# EAGLE design reactor (EAGLE 6.3)
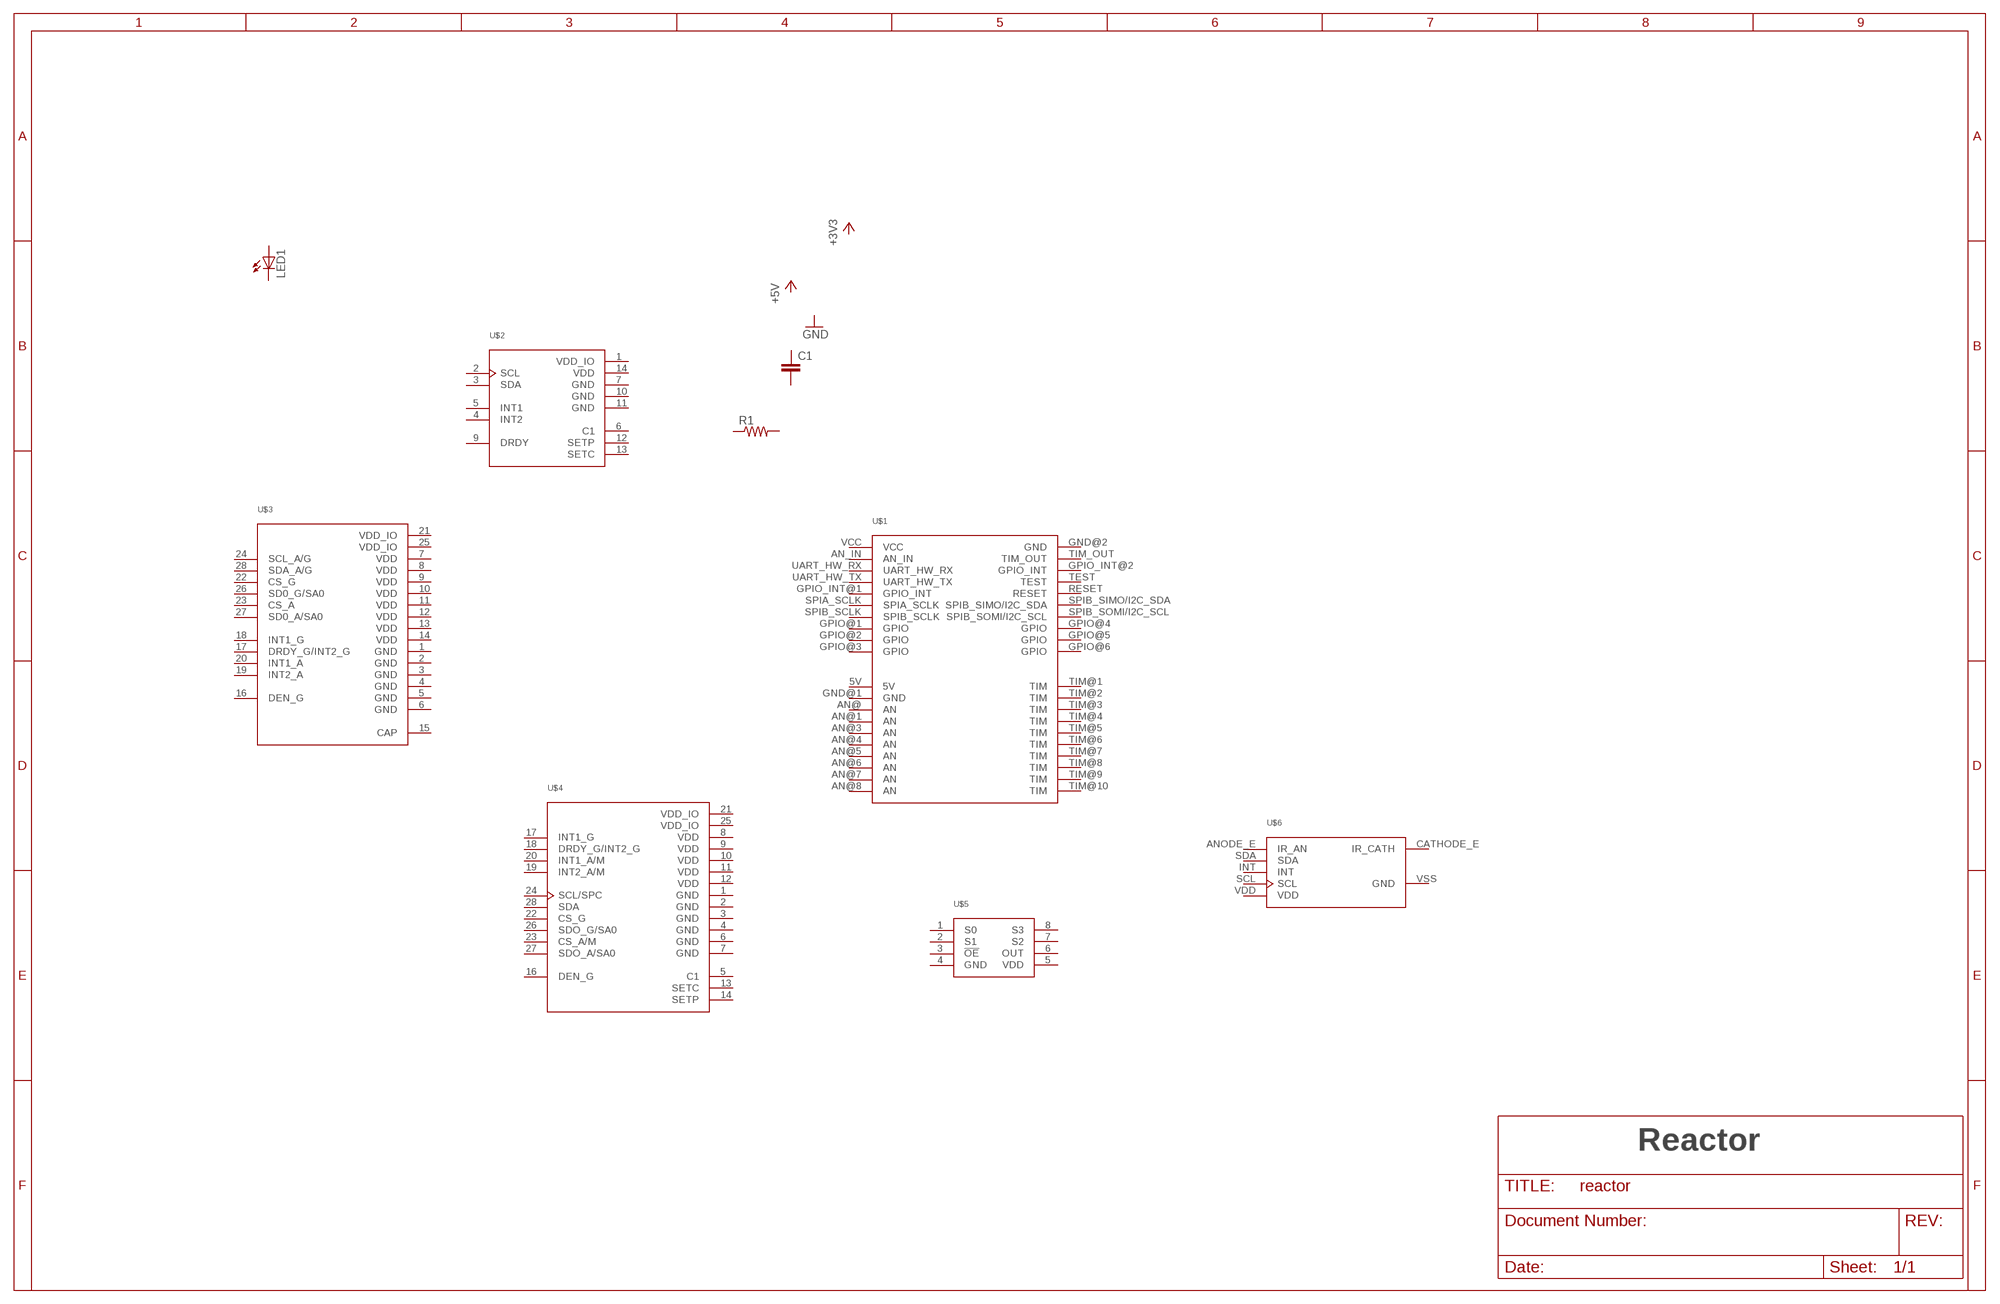
[diagram p0: schematic, sheet 1]

## Parts
C1  C-EUC0603  [C0603]
LED1  LEDCHIP-LED0603  [CHIP-LED0603]
R1  R-US_R0603  [R0603]
U$1  LAUNCHPAD_BOOSTER_PACK  [LAUNCHPAD_BOOSTER_PACK]
U$2  LSM303DLHC  [LGA14]
U$3  LSM330DLC  [LGA28-4X5]
U$4  LSM333D  [LGA28]
U$5  TCS32X0  [SOIC8]
U$6  VCNL3020  [VCNL3020]
Unconnected: C1.1 C1.2 LED1.A LED1.C R1.1 R1.2 U$1.AN@1(AN) U$1.AN@3(AN) U$1.AN@4(AN) U$1.AN@5(AN) U$1.AN@6(AN) U$1.AN@7(AN) U$1.AN@8(AN) U$1.AN@(AN) U$1.AN_IN U$1.GPIO@1(GPIO) U$1.GPIO@2(GPIO) U$1.GPIO@3(GPIO) U$1.GPIO@4(GPIO) U$1.GPIO@5(GPIO) U$1.GPIO@6(GPIO) U$1.GPIO_INT@1(GPIO_INT) U$1.GPIO_INT@2(GPIO_INT) U$1.RESET U$1.SPIA_SCLK U$1.SPIB_SCLK U$1.SPIB_SIMO/I2C_SDA U$1.SPIB_SOMI/I2C_SCL U$1.TEST U$1.TIM@1(TIM) U$1.TIM@2(TIM) U$1.TIM@3(TIM) U$1.TIM@4(TIM) U$1.TIM@5(TIM) U$1.TIM@6(TIM) U$1.TIM@7(TIM) U$1.TIM@8(TIM) U$1.TIM@9(TIM) U$1.TIM@10(TIM) U$1.TIM_OUT U$1.UART_HW_RX U$1.UART_HW_TX U$2.1(VDD_IO) U$2.2(SCL) U$2.3(SDA) U$2.4(INT2) U$2.5(INT1) U$2.6(C1) U$2.7(GND) U$2.9(DRDY) U$2.10(GND) U$2.11(GND) U$2.12(SETP) U$2.13(SETC) U$2.14(VDD) U$3.1(GND) U$3.2(GND) U$3.3(GND) U$3.4(GND) U$3.5(GND) U$3.6(GND) U$3.7(VDD) U$3.8(VDD) U$3.9(VDD) U$3.10(VDD) U$3.11(VDD) U$3.12(VDD) U$3.13(VDD) U$3.14(VDD) U$3.15(CAP) U$3.16(DEN_G) U$3.17(DRDY_G/INT2_G) U$3.18(INT1_G) U$3.19(INT2_A) U$3.20(INT1_A) U$3.21(VDD_IO) U$3.22(CS_G) U$3.23(CS_A) U$3.24(SCL_A/G) U$3.25(VDD_IO) U$3.26(SD0_G/SA0) U$3.27(SD0_A/SA0) U$3.28(SDA_A/G) U$4.1(GND) U$4.2(GND) U$4.3(GND) U$4.4(GND) U$4.5(C1) U$4.6(GND) U$4.7(GND) U$4.8(VDD) U$4.9(VDD) U$4.10(VDD) U$4.11(VDD) U$4.12(VDD) U$4.13(SETC) U$4.14(SETP) U$4.16(DEN_G) U$4.17(INT1_G) U$4.18(DRDY_G/INT2_G) U$4.19(INT2_A/M) U$4.20(INT1_A/M) U$4.21(VDD_IO) U$4.22(CS_G) U$4.23(CS_A/M) U$4.24(SCL/SPC) U$4.25(VDD_IO) U$4.26(SDO_G/SA0) U$4.27(SDO_A/SA0) U$4.28(SDA) U$5.1(S0) U$5.2(S1) U$5.3(!OE) U$5.6(OUT) U$5.7(S2) U$5.8(S3) U$6.ANODE_E(IR_AN) U$6.CATHODE_E(IR_CATH) U$6.INT U$6.SCL U$6.SDA

## Notes on the sheet
- Reactor

## Power pins joined to a net without a drawn wire
5V: U$1.5V
GND: U$1.GND@1(GND) U$1.GND@2(GND) U$5.4(GND) U$6.VSS(GND)
VCC: U$1.VCC
VDD: U$5.5(VDD) U$6.VDD

## Library data of the parts
C1 = rcl:C-EU: CAPACITOR, European symbol
LED1 = led:LED: LED OSRAM: - CHIPLED LG R971, LG N971, LY N971, LG Q971, LY Q971, LO R971, LY R971 LH N974, LH R974 LS Q976, LO Q976, LY Q976 LO Q996 - Hyper CHIPLED LW Q18S LB Q993, LB Q99A, LB R99A - SideLED LS A670, LO A670, LY A670, LG A670, LP A670 LB A673, LV A673, LT A673, LW A673 LH A674 LY A675 LS A676, LA A676, LO A676, LY A676, LW A676 LS A679, LY A679, LG A679 - Hyper Micro SIDELED® LS Y876, LA Y876, LO Y876, LY Y876 LT Y87S - SmartLED LW L88C, LW L88S LB L89C, LB L89S, LG L890 LS L89K, LO L89K, LY L89K LS L896, LA L896, LO L896, LY L896 - TOPLED LS T670, LO T670, LY T670, LG T670, LP T670 LSG T670, LSP T670, LSY T670, LOP T670, LYG T670 LG T671, LOG T671, LSG T671 LB T673, LV T673, LT T673, LW T673 LH T674 LS T676, LA T676, LO T676, LY T676, LB T676, LH T676, LSB T676, LW T676 LB T67C, LV T67C, LT T67C, LS T67K, LO T67K, LY T67K, LW E67C LS E67B, LA E67B, LO E67B, LY E67B, LB E67C, LV E67C, LT E67C LW T67C LS T679, LY T679, LG T679 LS T770, LO T770, LY T770, LG T770, LP T770 LB T773, LV T773, LT T773, LW T773 LH T774 LS E675, LA E675, LY E675, LS T675 LS T776, LA T776, LO T776, LY T776, LB T776 LHGB T686 LT T68C, LB T68C - Hyper Mini TOPLED® LB M676 - Mini TOPLED Santana® LG M470 LS M47K, LO M47K, LY M47K Source: http://www.osram.convergy.de LUXEON: - LUMILED® LXK2-PW12-R00, LXK2-PW12-S00, LXK2-PW14-U00, LXK2-PW14-V00 LXK2-PM12-R00, LXK2-PM12-S00, LXK2-PM14-U00 LXK2-PE12-Q00, LXK2-PE12-R00, LXK2-PE12-S00, LXK2-PE14-T00, LXK2-PE14-U00 LXK2-PB12-K00, LXK2-PB12-L00, LXK2-PB12-M00, LXK2-PB14-N00, LXK2-PB14-P00, LXK2-PB14-Q00 LXK2-PR12-L00, LXK2-PR12-M00, LXK2-PR14-Q00, LXK2-PR14-R00 LXK2-PD12-Q00, LXK2-PD12-R00, LXK2-PD12-S00 LXK2-PH12-R00, LXK2-PH12-S00 LXK2-PL12-P00, LXK2-PL12-Q00, LXK2-PL12-R00 Source: www.luxeon.com KINGBRIGHT: KA-3528ASYC Source: www.kingbright.com
R1 = rcl:R-US_: RESISTOR, American symbol
U$1 = Boards:LAUNCHPAD_BOOSTER_PACK
U$2 = BoneCapeParts:LSM303DLHC
U$3 = BoneCapeParts:LSM330DLC
U$4 = BoneCapeParts:LSM333D
U$5 = launchpad_bp:TCS32X0
U$6 = launchpad_bp:VCNL3020

## Net classes
0 default: width 0.152 mm, drill 0.381 mm, clearance 0.152 mm
1 pwr: width 0.305 mm, drill 0.381 mm, clearance 0.152 mm

## Board
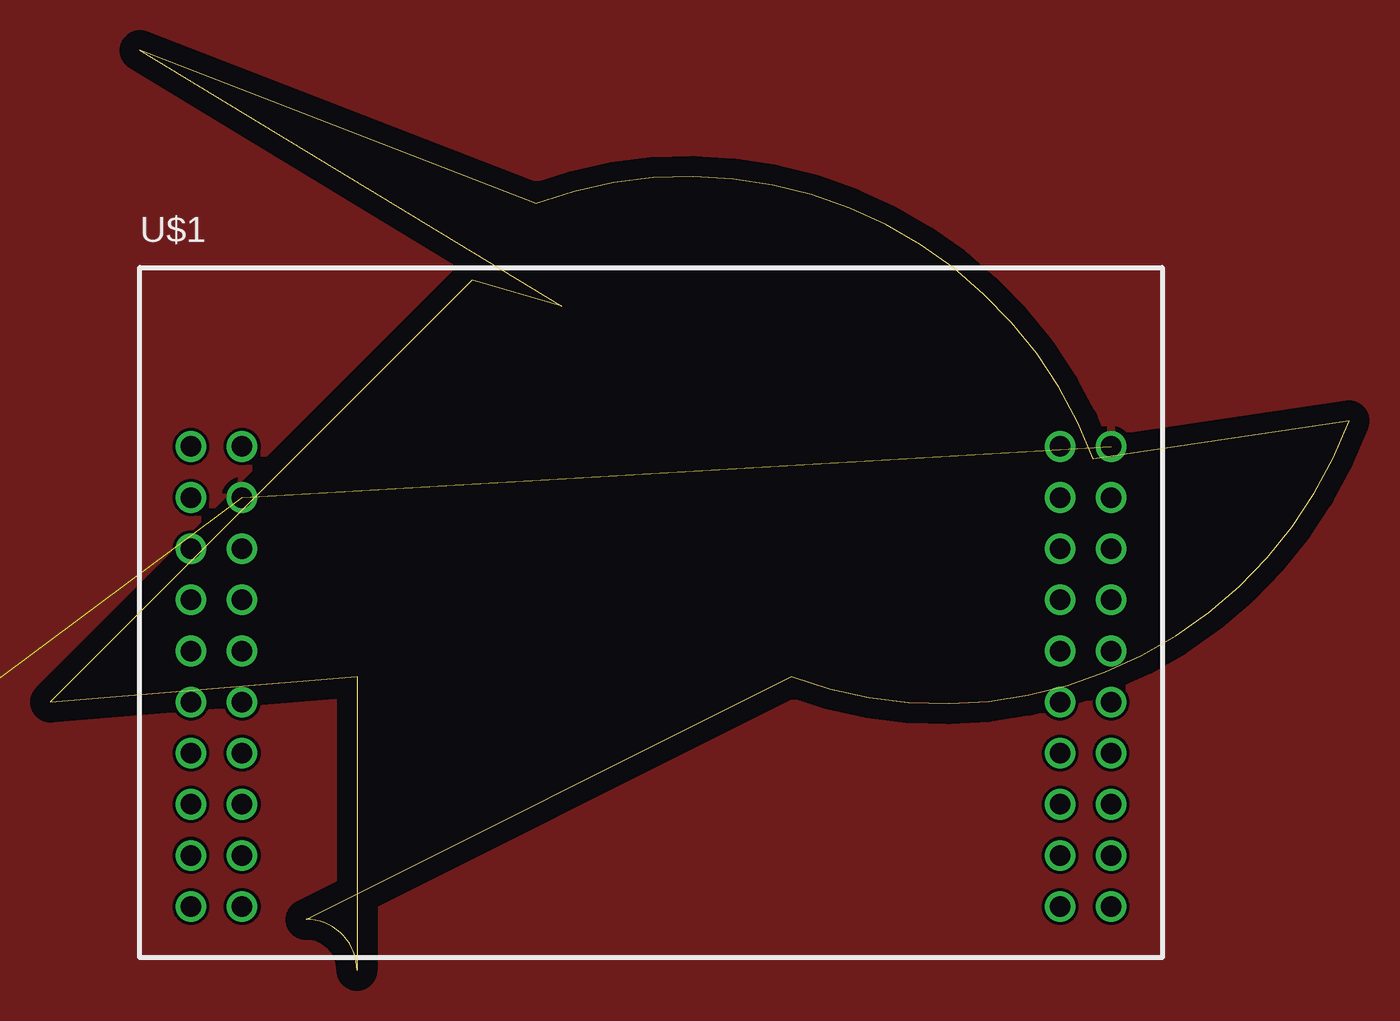
[diagram p1: board, top side]
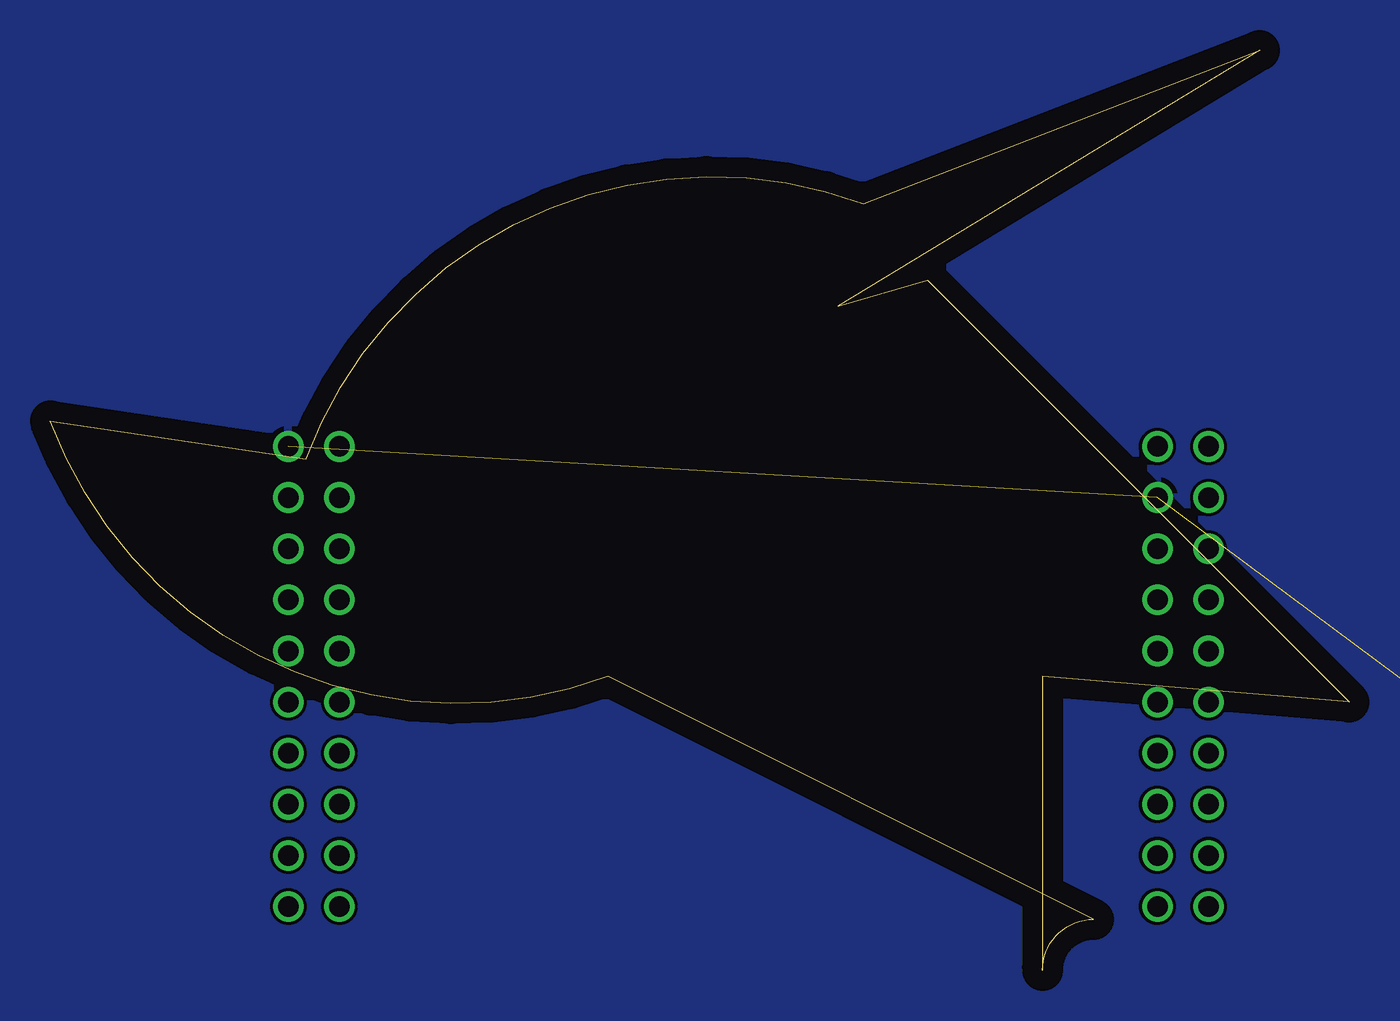
[diagram p2: board, bottom side, seen from below]

Size 64.53 x 45.72 mm. Coordinates in mm from the lower left corner, seen from the top.
Outline: 15.24,14.61 15.24,0 arc90 12.7,2.54 36.83,14.61 arc90 64.53,27.3 51.83,25.4 arc90 24.13,38.1 4.45,45.72 25.4,33.02 20.95,34.29 0,13.33 15.24,14.61
Copper layers (1*16): Top 0.035mm / dielectric 1.5mm / Bottom 0.035mm
Design rules "default *": minimum track width 6mil, minimum drill 15mil, track to track 6mil, track to pad 6mil, pad to pad 6mil, via to via 6mil, smd to smd 6mil, copper to edge 40mil, drill to drill 8mil, minimum pad ring 10mil, minimum via ring 8mil, stop-mask expansion 4mil, vias tented up to drill 20mil, thermal gap 10mil

### Footprints (pad centres in the part's own frame; a part is rotated, then mirrored left to right if it is on the bottom)
C0603 = smd 1.1 x 1: 1 -0.85,0; 2 0.85,0
CHIP-LED0603 = smd 0.8 x 0.8: A 0,-0.75; C 0,0.75
R0603 = smd 1 x 1.1: 1 -0.85,0; 2 0.85,0
LAUNCHPAD_BOOSTER_PACK = drill 1.016: 5V -20.32,8.89; AN@ -20.32,1.27; AN@1 -20.32,3.81; AN@3 -20.32,-1.27; AN@4 -20.32,-3.81; AN@5 -20.32,-6.35; AN@6 -20.32,-8.89; AN@7 -20.32,-11.43; AN@8 -20.32,-13.97; AN_IN -22.86,6.35; GND@1 -20.32,6.35; GND@2 22.86,8.89; GPIO@1 -22.86,-8.89; GPIO@2 -22.86,-11.43; GPIO@3 -22.86,-13.97; GPIO@4 22.86,-8.89; GPIO@5 22.86,-11.43; GPIO@6 22.86,-13.97; GPIO_INT@1 -22.86,-1.27; GPIO_INT@2 22.86,3.81; RESET 22.86,-1.27; SPIA_SCLK -22.86,-3.81; SPIB_SCLK -22.86,-6.35; SPIB_SIMO/I2C_SDA 22.86,-3.81; SPIB_SOMI/I2C_SCL 22.86,-6.35; TEST 22.86,1.27; TIM@1 20.32,8.89; TIM@2 20.32,6.35; TIM@3 20.32,3.81; TIM@4 20.32,1.27; TIM@5 20.32,-1.27; TIM@6 20.32,-3.81; TIM@7 20.32,-6.35; TIM@8 20.32,-8.89; TIM@9 20.32,-11.43; TIM@10 20.32,-13.97; TIM_OUT 22.86,6.35; UART_HW_RX -22.86,3.81; UART_HW_TX -22.86,1.27; VCC -22.86,8.89
LGA14 = smd 0.5 x 1.2: 1 2,1.1; 2 1.2,1.1; 3 0.4,1.1; 4 -0.4,1.1; 5 -1.2,1.1; 6 -2,1.1; 8 -2,-1.1; 9 -1.2,-1.1; 10 -0.4,-1.1; 11 0.4,-1.1; 12 1.2,-1.1; 13 2,-1.1 | smd 1.2 x 0.5: 7 -2.1,0; 14 2.1,0
LGA28-4X5 = smd 0.7 x 0.29: 1 -2.362,1.25; 2 -2.362,0.75; 3 -2.362,0.25; 4 -2.362,-0.25; 5 -2.362,-0.75; 6 -2.362,-1.25; 15 2.362,-1.25; 16 2.362,-0.75; 17 2.362,-0.25; 18 2.362,0.25; 19 2.362,0.75; 20 2.362,1.25 | smd 0.29 x 0.7: 7 -1.75,-1.863; 8 -1.25,-1.863; 9 -0.75,-1.863; 10 -0.25,-1.863; 11 0.25,-1.863; 12 0.75,-1.863; 13 1.25,-1.863; 14 1.75,-1.863; 21 1.75,1.863; 22 1.25,1.863; 23 0.75,1.863; 24 0.25,1.863; 25 -0.25,1.863; 26 -0.75,1.863; 27 -1.25,1.863; 28 -1.75,1.863
LGA28 = smd 0.7 x 0.29: 1 -2.9,0.75; 2 -2.9,0.25; 3 -2.9,-0.25; 4 -2.9,-0.75; 15 2.9,-0.75; 16 2.9,-0.25; 17 2.9,0.25; 18 2.9,0.75 | smd 0.29 x 0.7: 5 -2.25,-1.65; 6 -1.75,-1.65; 7 -1.25,-1.65; 8 -0.75,-1.65; 9 -0.25,-1.65; 10 0.25,-1.65; 11 0.75,-1.65; 12 1.25,-1.65; 13 1.75,-1.65; 14 2.25,-1.65; 19 2.25,1.65; 20 1.75,1.65; 21 1.25,1.65; 22 0.75,1.65; 23 0.25,1.65; 24 -0.25,1.65; 25 -0.75,1.65; 26 -1.25,1.65; 27 -1.75,1.65; 28 -2.25,1.65
SOIC8 = smd 0.6 x 2.2: 1 -1.905,-2.6; 2 -0.635,-2.6; 3 0.635,-2.6; 4 1.905,-2.6; 5 1.905,2.6; 6 0.635,2.6; 7 -0.635,2.6; 8 -1.905,2.6
VCNL3020 = smd 0.4 x 0.8: ANODE_E -1.61,-1.24; INT -0.24,-1.24; SCL 0.445,-1.24; SDA -0.925,-1.24; VDD 1.13,-1.24 | smd 0.83 x 0.8: CATHODE_E -1.45,0.85; CATHODE_PD 1.55,0.85; VSS 0.05,0.85

### Placement (x,y rotation side)
C1  -41.91,-21.59 0 top  (outside the outline)
LED1  -41.27,-31.12 0 top  (outside the outline)
R1  -41.91,-25.4 0 top  (outside the outline)
U$1  29.84,17.14 0 top
U$2  -26.04,-4.45 0 top  (outside the outline)
U$3  -31.75,-3.81 0 top  (outside the outline)
U$4  -31.12,-10.79 0 top  (outside the outline)
U$5  -39.37,-8.89 0 top  (outside the outline)
U$6  -40,-17.14 0 top  (outside the outline)

### Tracks (layer width: path | path; a pad name or v marks a point on that pad's centre or on a via)
GND  (3 unrouted)
  pour Bottom: -19.81,49.17 80.47,49.17 80.47,-7.32 -20.42,-7.32 -20.42,48.87
  pour Top: -20.32,50.09 80.16,50.09 80.16,-7.21 -20.83,-7.21 -20.83,50.19
VDD  (1 unrouted)

### Text on the board
tPlace: Interacto | hitchhikeree.org
bPlace: Interacto | hitchhikeree.org